# EAGLE design pc-001 (EAGLE 9.1.0)
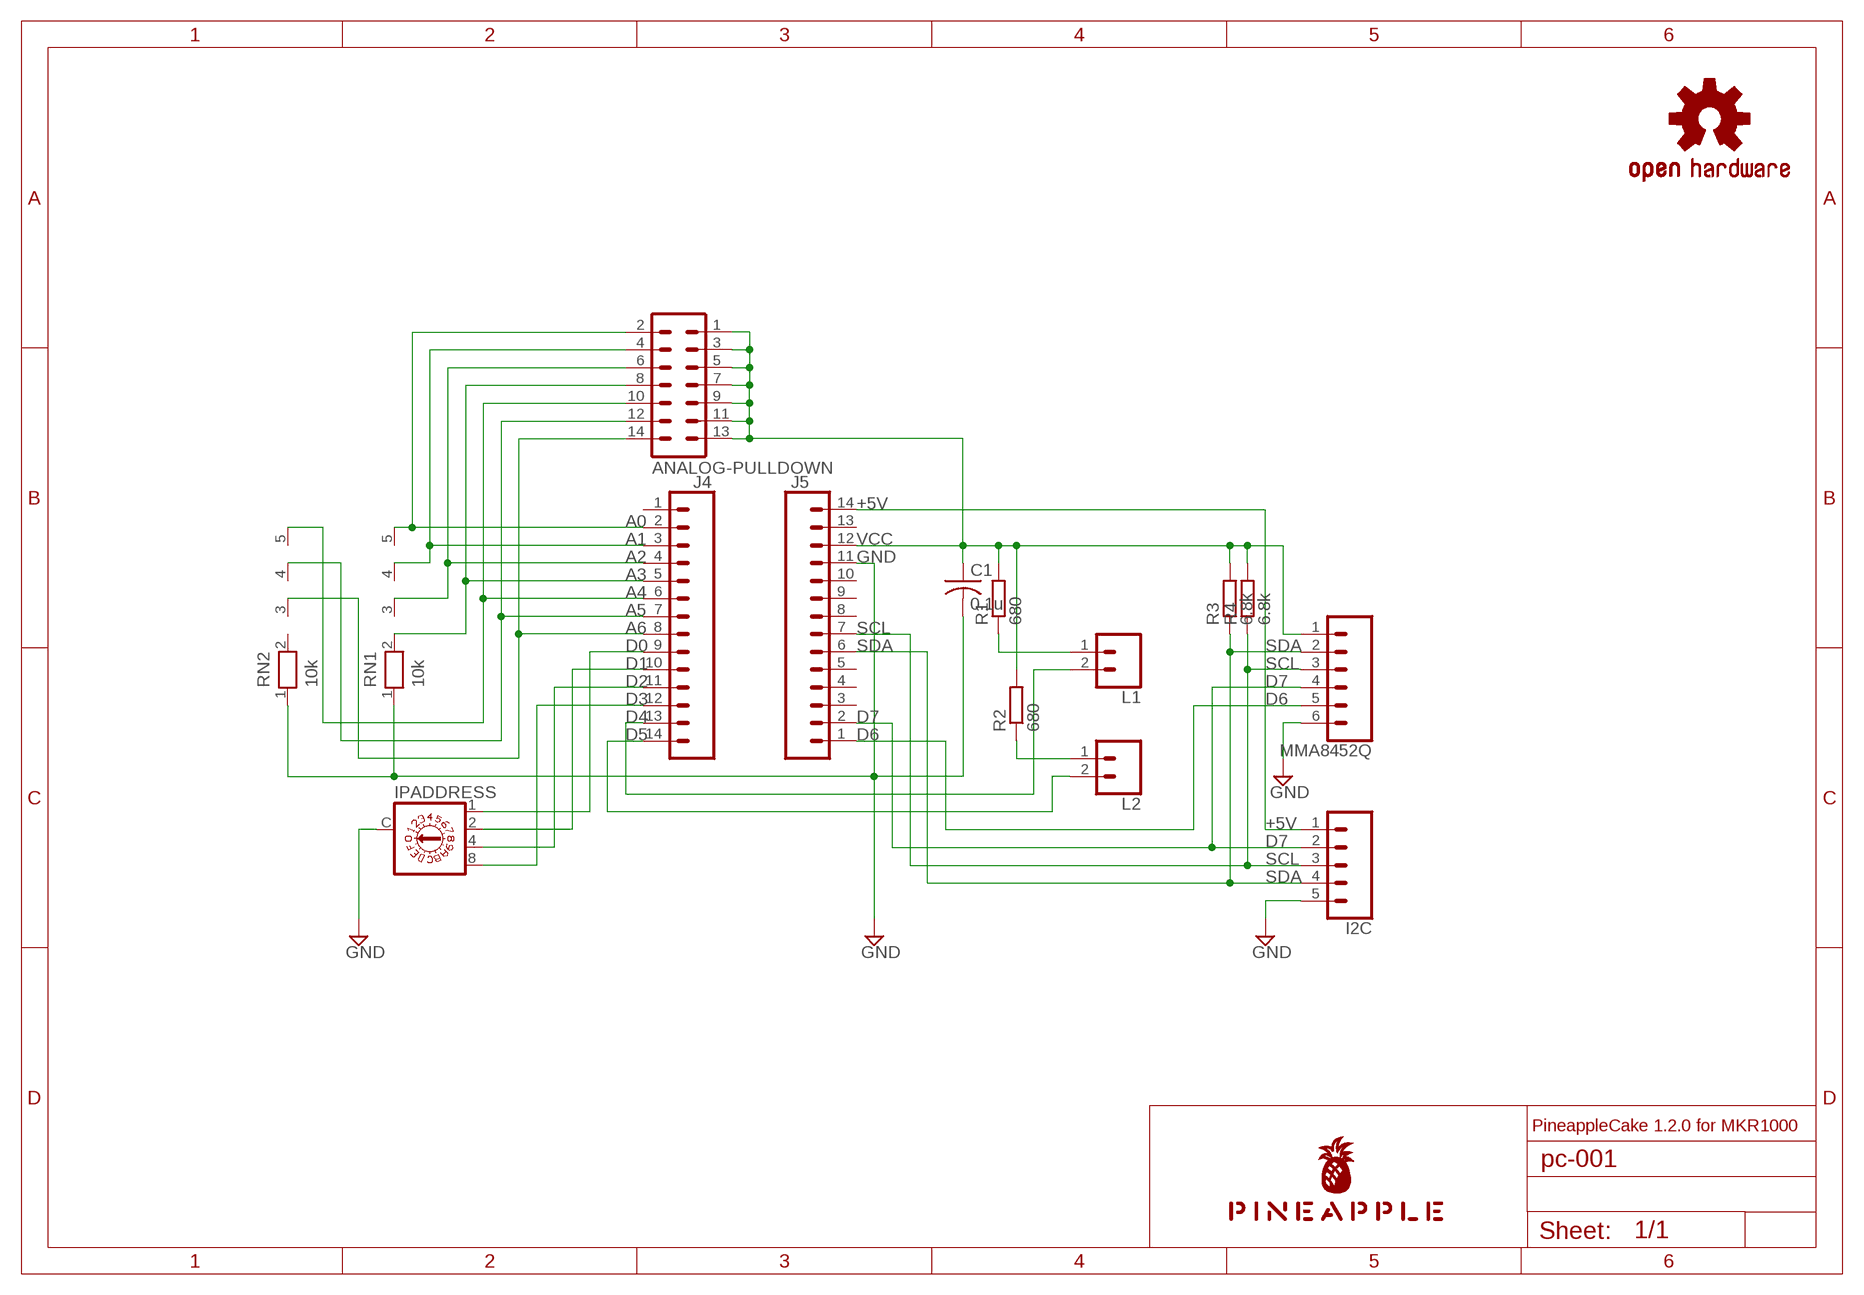
[diagram p0: schematic, sheet 1]

## Parts
ANALOG-PULLDOWN  ML14L  [ML14L]
C1  0.1u  C-US025-025X050  [C025-025X050]
I2C  CONN_05SMD  [1X05_1MM]
IPADDRESS  A1353HEX  [A1353HEX]
J4  DNP  CONN_14  [1X14]
J5  DNP  CONN_14  [1X14]
L1  CONN_02-JST-2-PTH-NO_SILK  [JST-2-PTH-NS]
L2  CONN_02-JST-2-PTH-NO_SILK  [JST-2-PTH-NS]
LOGO1  OSHW-LOGOS-COPPER  [OSHW-LOGO-S_COPPER]
MMA8452Q  CONN_06NO_SILK_FEMALE_PTH  [1X06_NO_SILK]
R1  680  R-EU_0204/5  [0204/5]
R2  680  R-EU_0204/5  [0204/5]
R3  6.8k  R-EU_0204/5  [0204/5]
R4  6.8k  R-EU_0204/5  [0204/5]
RN1  10k  RN04  [RN-5]
RN2  10k  RN04  [RN-5]
U$1  PINEAPPLE450  [PINEAPPLE450]

## Nets
+5V [power]: I2C.1 J5.14
A0: ANALOG-PULLDOWN.2 J4.2 RN1.5
A1: ANALOG-PULLDOWN.4 J4.3 RN1.4
A2: ANALOG-PULLDOWN.6 J4.4 RN1.3
A3: ANALOG-PULLDOWN.8 J4.5 RN1.2
A4: ANALOG-PULLDOWN.10 J4.6 RN2.5
A5: ANALOG-PULLDOWN.12 J4.7 RN2.4
A6: ANALOG-PULLDOWN.14 J4.8 RN2.3
D0: IPADDRESS.1 J4.9
D1: IPADDRESS.2 J4.10
D2: IPADDRESS.4 J4.11
D3: IPADDRESS.8 J4.12
D4: J4.13 L1.2
D5: J4.14 L2.2
D6: J5.1 MMA8452Q.5
D7: I2C.2 J5.2 MMA8452Q.4
GND [gnd]: C1.2 I2C.5 IPADDRESS.C J5.11 MMA8452Q.6 RN1.1 RN2.1
LED1A: L1.1 R1.1
LED2A: L2.1 R2.1
SCL: I2C.3 J5.7 MMA8452Q.3 R4.1
SDA: I2C.4 J5.6 MMA8452Q.2 R3.1
VCC [power]: ANALOG-PULLDOWN.1 ANALOG-PULLDOWN.3 ANALOG-PULLDOWN.5 ANALOG-PULLDOWN.7 ANALOG-PULLDOWN.9 ANALOG-PULLDOWN.11 ANALOG-PULLDOWN.13 C1.1 J5.12 MMA8452Q.1 R1.2 R2.2 R3.2 R4.2
Unconnected: J4.1 J5.3 J5.4 J5.5 J5.8 J5.9 J5.10 J5.13 RN2.2

## Notes on the sheet
- PineappleCake 1.2.0 for MKR1000

## Library data of the parts
ANALOG-PULLDOWN = con-ml:ML14L: HARTING; OC_FARNELL: unknown; OC_NEWARK: unknown
C1 = resistor:C-US: CAPACITOR, American symbol
I2C = SparkFun-Connectors:CONN_05: Multi connection point. Often used as Generic Header-pin footprint for 0.1 inch spaced/style header connections On any of the 0.1 inch spaced packages, you can populate with these: Break Away Headers - Straight <https://www.sparkfun.com/products/116> (PRT-00116) Break Away Male Headers - Right Angle <https://www.sparkfun.com/products/553> (PRT-00553) Female Headers <https://www.sparkfun.com/products/115> (PRT-00115) Break Away Headers - Machine Pin <https://www.sparkfun.com/products/117> (PRT-00117) Break Away Female Headers - Swiss Machine Pin <https://www.sparkfun.com/products/743> (PRT-00743) For SCREWTERMINALS and SPRING TERMINALS visit here: Screw Terimnals on SparkFun.com <https://www.sparkfun.com/search/results?term=Screw+Terminals> (5mm/3.5mm/2.54mm spacing) This device is also useful as a general connection point to wire up your design to another part of your project. Our various solder wires solder well into these plated through hole pads. Hook-Up Wire - Assortment (Stranded, 22 AWG) <https://www.sparkfun.com/products/11375> (PRT-11375) Hook-Up Wire - Assortment (Solid Core, 22 AWG) <https://www.sparkfun.com/products/11367> (PRT-11367) View the entire wire category on our website here <https://www.sparkfun.com/categories/141> Special notes: Molex polarized connector foot print use with SKU : PRT-08231 with associated crimp pins and housings. 1MM SMD Version SKU: PRT-10208; PROD_ID: CONN-08528; SF_ID: GPS-08288
IPADDRESS = switch-dil:A1353HEX: DIL/CODE SWITCH; OC_FARNELL: unknown; OC_NEWARK: unknown
J4 J5 = SparkFun-Connectors:CONN_14: Multi connection point. Often used as Generic Header-pin footprint for 0.1 inch spaced/style header connections On any of the 0.1 inch spaced packages, you can populate with these: Break Away Headers - Straight <https://www.sparkfun.com/products/116> (PRT-00116) Break Away Male Headers - Right Angle <https://www.sparkfun.com/products/553> (PRT-00553) Female Headers <https://www.sparkfun.com/products/115> (PRT-00115) Break Away Headers - Machine Pin <https://www.sparkfun.com/products/117> (PRT-00117) Break Away Female Headers - Swiss Machine Pin <https://www.sparkfun.com/products/743> (PRT-00743) For SCREWTERMINALS and SPRING TERMINALS visit here: Screw Terimnals on SparkFun.com <https://www.sparkfun.com/search/results?term=Screw+Terminals> (5mm/3.5mm/2.54mm spacing) This device is also useful as a general connection point to wire up your design to another part of your project. Our various solder wires solder well into these plated through hole pads. Hook-Up Wire - Assortment (Stranded, 22 AWG) <https://www.sparkfun.com/products/11375> (PRT-11375) Hook-Up Wire - Assortment (Solid Core, 22 AWG) <https://www.sparkfun.com/products/11367> (PRT-11367) View the entire wire category on our website here <https://www.sparkfun.com/categories/141> Special notes: Molex polarized connector foot print use with SKU : PRT-08231 with associated crimp pins and housings. 1MM SMD Version SKU: PRT-10208 NOTES ON THE VARIANTS LOCK and LOCK_LONGPADS... This footprint was designed to help hold the alignment of a through-hole component (i.e. 6-pin header) while soldering it into place. You may notice that each hole has been shifted either up or down by 0.005 of an inch from it's more standard position (which is a perfectly straight line). This slight alteration caused the pins (the squares in the middle) to touch the edges of the holes. Because they are alternating, it causes a "brace" to hold the component in place. 0.005 has proven to be the perfect amount of "off-center" position when using our standard breakaway headers. Although looks a little odd when you look at the bare footprint, once you have a header in there, the alteration is very hard to notice. Also,if you push a header all the way into place, it is covered up entirely on the bottom side.
L1 L2 = SparkFun-Connectors:CONN_02: Multi connection point. Often used as Generic Header-pin footprint for 0.1 inch spaced/style header connections On any of the 0.1 inch spaced packages, you can populate with these: Break Away Headers - Straight <https://www.sparkfun.com/products/116> (PRT-00116) Break Away Male Headers - Right Angle <https://www.sparkfun.com/products/553> (PRT-00553) Female Headers <https://www.sparkfun.com/products/115> (PRT-00115) Break Away Headers - Machine Pin <https://www.sparkfun.com/products/117> (PRT-00117) Break Away Female Headers - Swiss Machine Pin <https://www.sparkfun.com/products/743> (PRT-00743) For SCREWTERMINALS and SPRING TERMINALS visit here: Screw Terimnals on SparkFun.com <https://www.sparkfun.com/search/results?term=Screw+Terminals> (5mm/3.5mm/2.54mm spacing) This device is also useful as a general connection point to wire up your design to another part of your project. Our various solder wires solder well into these plated through hole pads. Hook-Up Wire - Assortment (Stranded, 22 AWG) <https://www.sparkfun.com/products/11375> (PRT-11375) Hook-Up Wire - Assortment (Solid Core, 22 AWG) <https://www.sparkfun.com/products/11367> (PRT-11367) View the entire wire category on our website here <https://www.sparkfun.com/categories/141> Special notes: Molex polarized connector foot print use with: PRT-08233 with associated crimp pins and housings. 2.54_SCREWTERM for use with PRT-10571. 3.5mm Screw Terminal footprints for PRT-08084 5mm Screw Terminal footprints for use with PRT-08432
LOGO1 = SparkFun-Aesthetics:OSHW-LOGO: Open-Source Hardware (OSHW) Logo This logo indicates the piece of hardware it is found on incorporates a OSHW license and/or adheres to the definition of open source hardware found here: http://freedomdefined.org/OSHW
MMA8452Q = SparkFun-Connectors:CONN_06: Multi connection point. Often used as Generic Header-pin footprint for 0.1 inch spaced/style header connections On any of the 0.1 inch spaced packages, you can populate with these: Break Away Headers - Straight <https://www.sparkfun.com/products/116> (PRT-00116) Break Away Male Headers - Right Angle <https://www.sparkfun.com/products/553> (PRT-00553) Female Headers <https://www.sparkfun.com/products/115> (PRT-00115) Break Away Headers - Machine Pin <https://www.sparkfun.com/products/117> (PRT-00117) Break Away Female Headers - Swiss Machine Pin <https://www.sparkfun.com/products/743> (PRT-00743) Arduino Stackable Header - 6 Pin <https://www.sparkfun.com/products/9280> (PRT-09280) For SCREWTERMINALS and SPRING TERMINALS visit here: Screw Terimnals on SparkFun.com <https://www.sparkfun.com/search/results?term=Screw+Terminals> (5mm/3.5mm/2.54mm spacing) This device is also useful as a general connection point to wire up your design to another part of your project. Our various solder wires solder well into these plated through hole pads. Hook-Up Wire - Assortment (Stranded, 22 AWG) <https://www.sparkfun.com/products/11375> (PRT-11375) Hook-Up Wire - Assortment (Solid Core, 22 AWG) <https://www.sparkfun.com/products/11367> (PRT-11367) View the entire wire category on our website here <https://www.sparkfun.com/categories/141>; PROD_ID: CONN-08437
R1-R4 = resistor:R-EU_: RESISTOR, European symbol
RN1 RN2 = resistor-net:RN04: RESISTOR NETWORK; OC_FARNELL: unknown; OC_NEWARK: unknown
U$1 = pineapple:PINEAPPLE450

## Net classes
0 default: width 0.152 mm, drill 0.152 mm, clearance 0.152 mm
1 gnd: width 0.305 mm, drill 0.152 mm, clearance 0.152 mm
2 power: width 0.61 mm, drill 0.152 mm, clearance 0.152 mm

## Board
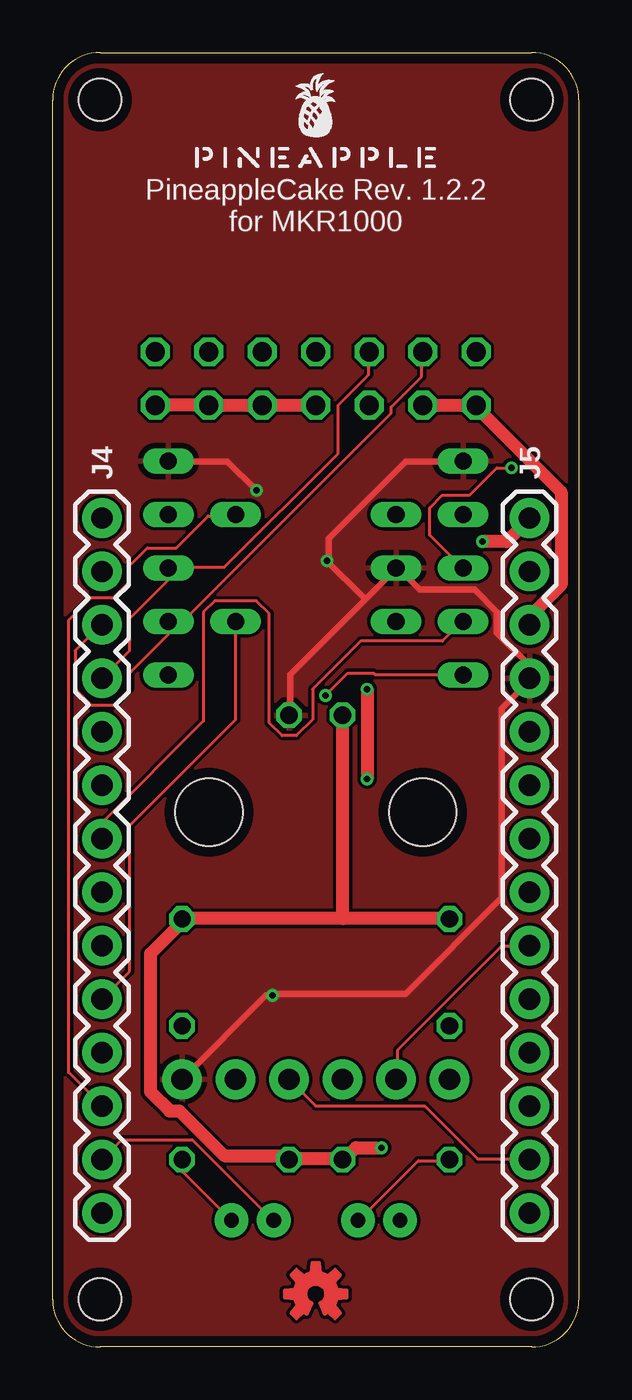
[diagram p1: board, top side]
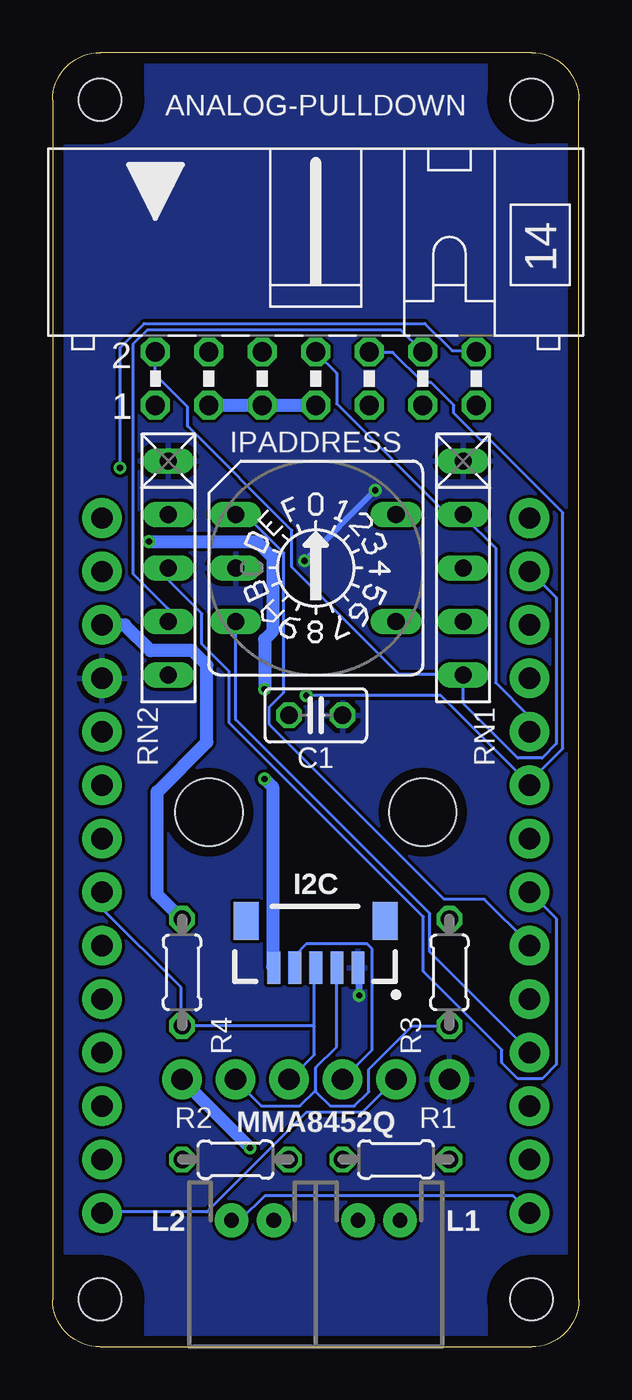
[diagram p2: board, bottom side, seen from below]

Size 25 x 61.5 mm. Coordinates in mm from the lower left corner, seen from the top.
Outline: 0,2.25 0,59.25 arc-90 2.25,61.5 22.75,61.5 arc-90 25,59.25 25,2.25 arc-90 22.75,0 2.25,0 arc-90 0,2.25
Copper layers (1*16): Top 0.035mm / dielectric 1.53mm / Bottom 0.035mm
Design rules "pban_5mil-l2": minimum track width 5mil, minimum drill 0.3mm, track to track 5mil, track to pad 0.229mm, pad to pad 5mil, via to via 5mil, smd to smd 5mil, copper to edge 0.5mm, drill to drill 0.5mm, minimum pad ring 0.15mm, minimum via ring 0.15mm, stop-mask expansion 4mil, vias tented up to drill 0.35mm, thermal gap 10mil
Holes 2 mm at 2.25,59.26 22.75,59.26 22.75,2.26 2.25,2.26
Holes 3.2 mm at 17.58,25.41 7.42,25.41
bRestrict: area 0.3,57.3 to 4.2,61.2; area 20.8,57.3 to 24.7,61.2; area 0.3,0.3 to 4.2,4.2; area 20.8,0.3 to 24.7,4.2; 8 lines

### Footprints (pad centres in the part's own frame; a part is rotated, then mirrored left to right if it is on the bottom)
ML14L = drill 0.914 octagon: 1 -7.62,-1.27; 2 -7.62,1.27; 3 -5.08,-1.27; 4 -5.08,1.27; 5 -2.54,-1.27; 6 -2.54,1.27; 7 0,-1.27; 8 0,1.27; 9 2.54,-1.27; 10 2.54,1.27; 11 5.08,-1.27; 12 5.08,1.27; 13 7.62,-1.27; 14 7.62,1.27
C025-025X050 = drill 0.813 octagon: 1 -1.27,0; 2 1.27,0
1X05_1MM = smd 0.6 x 1.55: 1 -2,0; 2 -1,0; 3 0,0; 4 1,0; 5 2,0 | smd 1.2 x 1.8: NC1 -3.3,2.225; NC2 3.3,2.225
A1353HEX = drill 0.813 long: 1 3.81,-2.54; 2 -3.81,2.54; 4 3.81,2.54; 8 -3.81,-2.54; C 3.81,0
1X14 = drill 1.016 pad 1.88: 1 0,0; 2 2.54,0; 3 5.08,0; 4 7.62,0; 5 10.16,0; 6 12.7,0; 7 15.24,0; 8 17.78,0; 9 20.32,0; 10 22.86,0; 11 25.4,0; 12 27.94,0; 13 30.48,0; 14 33.02,0
JST-2-PTH-NS = drill 0.7 pad 1.6: 1 -1,0; 2 1,0
1X06_NO_SILK = drill 1.016 pad 1.88: 1 0,0; 2 2.54,0; 3 5.08,0; 4 7.62,0; 5 10.16,0; 6 12.7,0
0204/5 = drill 0.813 octagon: 1 -2.54,0; 2 2.54,0
RN-5 = drill 0.813 long: 1 -5.08,0; 2 -2.54,0; 3 0,0; 4 2.54,0; 5 5.08,0

### Placement (x,y rotation side)
ANALOG-PULLDOWN  12.5,46.01 0 bottom
C1  12.5,30.01 0 bottom
I2C  12.5,18.01 0 bottom
IPADDRESS  12.5,37.01 180 bottom
J4  2.34,39.38 270 top
J5  22.66,6.36 90 top
L1  9.5,6.01 180 bottom
L2  15.5,6.01 180 bottom
LOGO1  12.5,2.51 0 top
MMA8452Q  18.85,12.71 0 bottom
R1  8.69,8.9 180 bottom
R2  16.31,8.9 0 bottom
R3  6.15,17.79 90 bottom
R4  18.85,17.79 90 bottom
RN1  5.5,37.01 270 bottom
RN2  19.5,37.01 270 bottom
U$1  12.5,56.01 0 top

### Tracks (layer width: path | path; a pad name or v marks a point on that pad's centre or on a via)
+5V  (via drill 0.3)
  Top 0.61: v14.94,31.25 v14.94,26.99 | v20.42,38.26 21.57,38.26 22.63,39.33 J5.14
  Bottom 0.61: v14.94,26.99 14.55,26.61 14.55,18.07 I2C.1 | v14.94,31.25 14.94,33.62 14.55,34 14.55,37.5 15.32,38.26 v20.42,38.26
A0
  Bottom 0.152: J4.2 2.29,36.82 1.07,35.6 1.07,28.66 1.75,27.98 2.9,27.98 5.49,30.57 5.49,31.86 RN1.5 5.56,31.94 8.53,31.94 13.64,37.05 13.64,38.8 18.59,43.75 18.59,44.66 20.12,46.19 20.12,47.26 ANALOG-PULLDOWN.2
A1
  Top 0.152: J4.3 2.29,34.3 1.07,33.08 1.07,31.25 1.83,30.49 2.9,30.49 3.66,31.25 3.66,32.02 5.49,33.84 5.49,34.45 RN1.4 5.56,34.53 6.25,34.53 16.08,44.36 16.08,44.66 17.53,46.11 17.53,47.26 ANALOG-PULLDOWN.4
A2
  Top 0.152: J4.4 2.36,31.79 3.66,33.08 3.66,34.61 5.49,36.44 5.49,36.97 RN1.3 5.56,37.05 8.15,37.05 13.56,42.45 13.56,44.74 15.01,46.19 15.01,47.26 ANALOG-PULLDOWN.6
A3
  Bottom 0.152: ANALOG-PULLDOWN.8 12.5,47.26 11.51,46.27 11.51,44.82 6.25,39.56 5.56,39.56 RN1.2 5.49,39.48 3.96,37.96 3.96,31.56 2.36,29.96 2.36,29.27 J4.5
A4  (via drill 0.3)
  Top 0.152: v12.95,30.95 14.02,32.02 15.24,32.02 15.32,31.94 19.43,31.94 RN2.5
  Bottom 0.152: v12.95,30.95 6.55,30.95 2.36,26.76 J4.6 2.36,26.83 0.76,28.43 0.76,39.64 4.19,43.06 4.65,43.06 5.94,44.36 5.94,44.74 7.01,45.81 7.39,45.81 8.84,47.26 9.91,47.26 ANALOG-PULLDOWN.10
A5
  Top 0.152: J4.7 2.36,24.17 2.36,24.93 7.16,29.73 7.16,34.91 7.7,35.45 9.68,35.45 10.29,34.84 10.29,29.65 10.9,29.04 11.58,29.04 12.34,29.81 12.34,31.25 14.63,33.54 18.52,33.54 19.43,34.45 RN2.4
  Bottom 0.152: RN2.4 19.51,34.53 19.51,35.06 21.18,36.74 21.18,47.64 20.5,48.32 8.46,48.32 7.47,47.33 ANALOG-PULLDOWN.12
A6  (via drill 0.3)
  Top 0.152: v21.79,41.77 21.11,41.77 19.81,40.47 18.52,40.47 17.91,39.87 17.91,38.57 19.43,37.05 RN2.3
  Bottom 0.152: RN2.3 19.43,36.97 19.43,36.36 17.91,34.84 17.91,33.39 16.61,32.09 16.61,29.65 7.39,20.43 7.39,17.84 3.66,14.11 3.66,13.5 2.9,12.74 1.75,12.74 1.07,13.42 1.07,20.36 2.29,21.58 J4.8 | v21.79,41.77 21.79,47.48 20.65,48.63 7.32,48.63 6.02,47.33 4.95,47.33 ANALOG-PULLDOWN.14
D0
  Bottom 0.152: IPADDRESS.1 16.31,39.48 15.77,39.48 14.02,37.73 14.02,31.1 14.71,30.42 14.71,29.58 6.4,21.27 4.5,21.27 2.36,19.14 J4.9
D1
  Top 0.152: IPADDRESS.2 8.69,34.45 8.69,29.81 3.66,24.78 3.66,17.84 2.36,16.55 J4.10
D2
  Bottom 0.152: IPADDRESS.4 16.31,34.45 16.31,29.81 7.09,20.59 7.09,18.76 2.36,14.03 J4.11
D3
  Top 0.152: IPADDRESS.8 8.69,39.48 7.39,39.48 5.87,37.96 4.5,37.96 3.66,37.12 3.66,36.36 2.9,35.6 1.83,35.6 0.76,34.53 0.76,13.04 2.29,11.52 J4.12
D4
  Top 0.152: L1.2 10.44,6.03 6.63,9.84 3.28,9.84 2.36,8.93 J4.13
D5
  Bottom 0.152: L2.2 16.46,6.03 16.08,6.03 14.94,7.17 3.12,7.17 2.36,6.41 J4.14
D6
  Bottom 0.152: J5.1 22.63,6.41 17.68,6.41 12.95,11.14 10.29,11.14 8.76,12.66 MMA8452Q.5
D7
  Top 0.152: J5.2 22.63,8.93 20.19,8.93 17.68,11.44 12.5,11.44 11.28,12.66 MMA8452Q.4
  Bottom 0.152: I2C.2 13.49,18.07 13.49,18.61 12.95,19.14 10.06,19.14 9.83,18.91 9.83,14.11 11.2,12.74 MMA8452Q.4
GND  (via drill 0.3)
  Top 0.305: MMA8452Q.6 6.17,12.74 10.13,16.7 v10.44,16.7 10.52,16.78 16.76,16.78 21.34,21.35 21.34,30.34 22.63,31.64 J5.11 22.63,31.79 22.63,32.4 21.11,33.92 21.11,34.91 20.04,35.98 17.45,35.98 16.46,36.97 IPADDRESS.C 16.31,36.97 14.86,35.52 | 14.86,35.52 11.28,31.94 11.28,30.04 C1.2 | v9.68,40.7 8.31,42.07 5.56,42.07 RN1.1 | 14.86,35.52 14.78,35.6 v13.03,37.35 13.11,37.43 13.11,38.42 16.76,42.07 19.43,42.07 RN2.1
  Bottom 0.305: v10.44,16.7 10.44,18 I2C.5 | v13.03,37.35 v9.68,40.7
  pour Top: -1,-0.99 26,-0.99 26,62.01 -1,62.01
  pour Bottom: -2,-1.99 27,-1.99 27,63.01 -2,63.01
LED1A
  Top 0.152: R1.1 6.17,8.85 6.17,8.32 8.46,6.03 L1.1
LED2A
  Top 0.152: R2.1 18.82,8.85 17.37,8.85 14.55,6.03 L2.1
SCL
  Bottom 0.152: 12.57,15.25 12.57,13.88 13.72,12.74 MMA8452Q.3 | 12.57,15.25 12.57,18 I2C.3 | 12.57,15.25 18.82,15.25 R4.1 18.9,15.25 18.9,17.08 22.63,20.82 22.63,21.58 J5.7
SDA
  Top 0.152: J5.6 22.63,19.06 21.34,19.06 16.38,14.11 16.38,12.74 MMA8452Q.2
  Bottom 0.152: 12.54,12.17 13.26,11.44 15.09,11.44 16.31,12.66 MMA8452Q.2 | 12.54,12.17 12.5,12.2 12.5,13.27 11.51,14.26 11.51,18 I2C.4 | R3.1 6.17,15.25 7.92,15.25 9.98,13.2 9.98,12.13 10.67,11.44 11.81,11.44 12.5,12.13 12.54,12.17
VCC  (via drill 0.3)
  Top 0.61: ANALOG-PULLDOWN.13 4.95,44.74 7.39,44.74 ANALOG-PULLDOWN.11 7.7,44.74 9.91,44.74 ANALOG-PULLDOWN.9 10.21,44.74 ANALOG-PULLDOWN.7 | ANALOG-PULLDOWN.3 17.6,44.74 ANALOG-PULLDOWN.1 20.27,44.51 24.16,40.63 24.16,36.21 22.71,34.76 22.71,34.38 J5.12 | 13.79,20.36 18.82,20.36 R4.2 | 13.79,20.36 6.17,20.36 R3.2 6.02,20.05 4.65,18.68 4.65,12.13 5.56,11.21 6.02,11.21 8.15,9.08 10.97,9.08 R1.2 11.28,8.93 13.72,8.93 R2.2 14.02,9.08 14.4,9.46 v15.62,9.46 | C1.1 13.79,29.96 13.79,20.59 13.79,20.36
  Bottom 0.61: ANALOG-PULLDOWN.3 17.53,44.74 15.09,44.74 ANALOG-PULLDOWN.5 14.78,44.74 12.57,44.74 ANALOG-PULLDOWN.7 | v15.62,9.46 18.82,12.66 MMA8452Q.1 | J5.12 22.63,34.3 21.57,34.3 20.34,33.08 18.36,33.08 17.68,32.4 17.68,28.74 20.04,26.38 20.04,21.5 18.9,20.36 R4.2

### Text on the board
tNames: PineappleCake Rev. 1.2.2 | for MKR1000